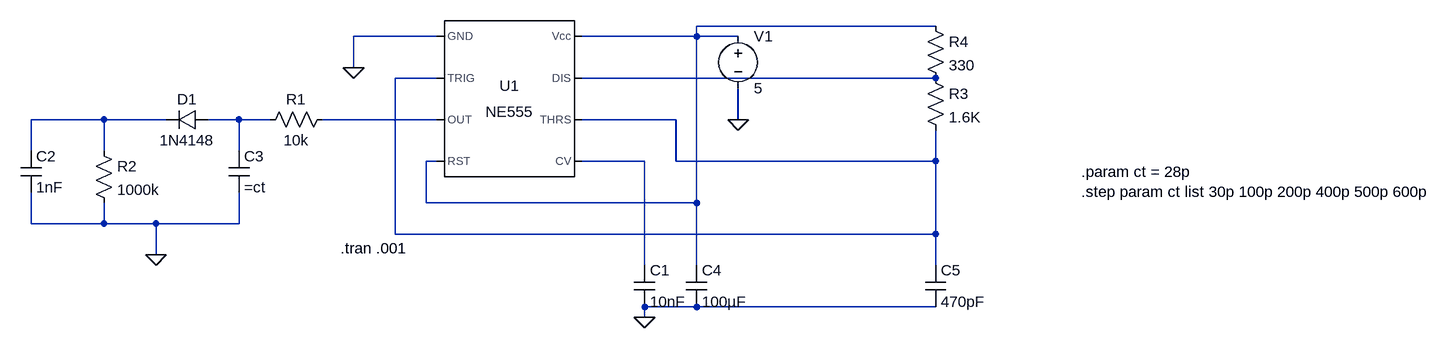
[diagram p0: schematic 555_analogue.asc]
555_analogue.asc, the LTspice schematic file:
Version 4
SHEET 1 1504 680
WIRE 688 64 320 64
WIRE -80 80 -208 80
WIRE 320 80 320 64
WIRE 320 80 144 80
WIRE 384 80 320 80
WIRE -208 128 -208 80
WIRE -80 144 -144 144
WIRE 688 144 144 144
WIRE -592 208 -704 208
WIRE -496 208 -592 208
WIRE -384 208 -432 208
WIRE -336 208 -384 208
WIRE -80 208 -256 208
WIRE 288 208 144 208
WIRE 384 208 384 160
WIRE -704 256 -704 208
WIRE -592 256 -592 208
WIRE -384 256 -384 208
WIRE -80 272 -96 272
WIRE 240 272 144 272
WIRE 288 272 288 208
WIRE 688 272 688 224
WIRE 688 272 288 272
WIRE -96 336 -96 272
WIRE 320 336 320 80
WIRE 320 336 -96 336
WIRE -704 368 -704 320
WIRE -592 368 -592 336
WIRE -592 368 -704 368
WIRE -512 368 -592 368
WIRE -384 368 -384 320
WIRE -384 368 -512 368
WIRE -144 384 -144 144
WIRE 688 384 688 272
WIRE 688 384 -144 384
WIRE -512 416 -512 368
WIRE 240 432 240 272
WIRE 320 432 320 336
WIRE 688 432 688 384
WIRE 320 496 240 496
WIRE 688 496 320 496
WIRE 240 512 240 496
FLAG -208 128 0
FLAG 384 208 0
FLAG 240 512 0
FLAG -512 416 0
SYMBOL Misc\\NE555 32 176 R0
SYMATTR InstName U1
SYMBOL voltage 384 64 R0
WINDOW 123 0 0 Left 0
WINDOW 39 0 0 Left 0
SYMATTR InstName V1
SYMATTR Value 5
SYMBOL cap 224 432 R0
SYMATTR InstName C1
SYMATTR Value 10nF
SYMBOL res -240 192 R90
WINDOW 0 0 56 VBottom 2
WINDOW 3 32 56 VTop 2
SYMATTR InstName R1
SYMATTR Value 10k
SYMBOL diode -432 192 R90
WINDOW 0 0 32 VBottom 2
WINDOW 3 32 32 VTop 2
SYMATTR InstName D1
SYMATTR Value 1N4148
SYMBOL res -608 240 R0
SYMATTR InstName R2
SYMATTR Value 1000k
SYMBOL cap -720 256 R0
SYMATTR InstName C2
SYMATTR Value 1nF
SYMBOL cap -400 256 R0
SYMATTR InstName C3
SYMATTR Value =ct
SYMBOL cap 304 432 R0
SYMATTR InstName C4
SYMATTR Value 100µF
SYMBOL res 672 128 R0
SYMATTR InstName R3
SYMATTR Value 1.6K
SYMBOL res 672 48 R0
SYMATTR InstName R4
SYMATTR Value 330
SYMBOL cap 672 432 R0
SYMATTR InstName C5
SYMATTR Value 470pF
TEXT -228 406 Left 2 !.tran .001
TEXT 912 288 Left 2 !.param ct = 28p\n.step param ct list 30p 100p 200p 400p 500p 600p

The netlist it stands for:
* 555_analogue.asc
XU1 0 N002 N006 N001 N007 N002 N003 N001 NE555  ; pins GND TRIG OUT RST CV THRS DIS Vcc
V1 N001 0 5
C1 N007 0 10nF
R1 N006 N005 10k
D1 N005 N004 1N4148
R2 N004 0 1000k
C2 N004 0 1nF
C3 N005 0 =ct
C4 N001 0 100µF
R3 N003 N002 1.6K
R4 N001 N003 330
C5 N002 0 470pF
.model D D
.lib standard.dio
.tran .001
.param ct = 28p
.step param ct list 30p 100p 200p 400p 500p 600p
.lib NE555.sub
.backanno
.end